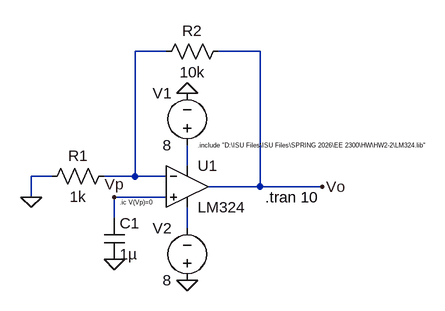
[diagram p0: schematic Draft1.asc]
Draft1.asc, the LTspice schematic file:
Version 4.1
SHEET 1 1116 680
WIRE 208 -144 160 -144
WIRE 352 -144 288 -144
WIRE 240 32 240 0
WIRE 32 48 0 48
WIRE 160 48 160 -144
WIRE 160 48 112 48
WIRE 208 48 160 48
WIRE 352 64 352 -144
WIRE 352 64 272 64
WIRE 448 64 352 64
WIRE 0 80 0 48
WIRE 208 80 128 80
WIRE 128 112 128 80
WIRE 240 128 240 96
FLAG 128 176 0
FLAG 0 80 0
FLAG 128 80 Vp
FLAG 240 -80 0
FLAG 240 208 0
FLAG 448 64 Vo
SYMBOL OpAmps\\opamp2 240 0 R0
SYMATTR InstName U1
SYMATTR Value LM324
SYMBOL cap 112 112 R0
SYMATTR InstName C1
SYMATTR Value 1µ
SYMBOL res 128 32 R90
WINDOW 0 0 56 VBottom 2
WINDOW 3 32 56 VTop 2
SYMATTR InstName R1
SYMATTR Value 1k
SYMBOL res 304 -160 R90
WINDOW 0 0 56 VBottom 2
WINDOW 3 32 56 VTop 2
SYMATTR InstName R2
SYMATTR Value 10k
SYMBOL voltage 240 16 R180
WINDOW 0 24 96 Left 2
WINDOW 3 24 16 Left 2
WINDOW 123 0 0 Left 0
WINDOW 39 0 0 Left 0
SYMATTR InstName V1
SYMATTR Value 8
SYMBOL voltage 240 224 R180
WINDOW 0 24 96 Left 2
WINDOW 3 24 16 Left 2
WINDOW 123 0 0 Left 0
WINDOW 39 0 0 Left 0
SYMATTR InstName V2
SYMATTR Value 8
TEXT 256 0 Left 0 !.include "D:\\ISU Files\\ISU Files\\SPRING 2026\\EE 2300\\HW\\HW2-2\\LM324.lib"
TEXT 136 88 Left 0 !.ic V(Vp)=0
TEXT 360 80 Left 2 !.tran 10

The netlist it stands for:
* Draft1.asc
X§U1 Vp N001 N002 N003 Vo LM324  ; pins In+ In- V+ V- OUT
C1 Vp 0 1µ
R1 N001 0 1k
R2 Vo N001 10k
V1 N002 0 8
V2 0 N003 8
.include "D:\ISU Files\ISU Files\SPRING 2026\EE 2300\HW\HW2-2\LM324.lib"
.ic V(Vp)=0
.tran 10
.backanno
.end